# Altium schematic sheet JTAG.SchDoc
size A4
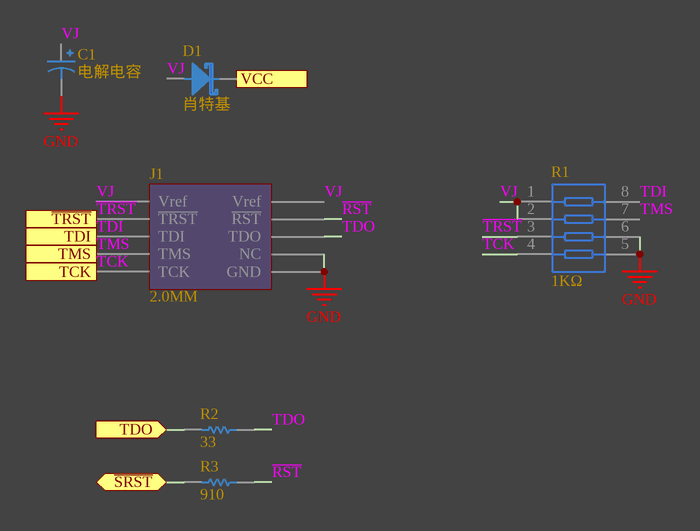
[diagram p0: JTAG.SchDoc]

## Parts
C1  电解电容  [贴片电解 4*5.4]
D1  肖特基  [SOD-123]
J1  2.0MM  [IDC-10P]
R1  1KΩ  [0603_Rx4]
R2  33  [R0603]
R3  910  [R0603]

## Ports
TCK (out), TDI (out), TDO (in), TMS (out), VCC (out), ~{SRST} (bidir), ~{TRST} (out)

## Nets
GND: C1.2 J1.8(NC) J1.10(GND) R1.5 R1.6
~{RST}: J1.4(~{RST}) R3.1
~{SRST}: R3.2 ; port ~{SRST}
~{TRST}: J1.3(~{TRST}) R1.3 ; port ~{TRST}
TCK: J1.9(TCK) R1.4 ; port TCK
TDI: J1.5(TDI) R1.8 ; port TDI
TDO: J1.6(TDO) R2.1
TDO: R2.2 ; port TDO  [a separate net that carries the same name]
TMS: J1.7(TMS) R1.7 ; port TMS
VCC: D1.2(K) ; port VCC
VJ: C1.1 D1.1(A) J1.1(Vref) J1.2(Vref) R1.1 R1.2

## Library data of the parts
C1 = 电解电容: Polarized Capacitor (Axial); Value: 100pF; Published: 8-Jun-2000; LatestRevisionDate: 17-Jul-2002; LatestRevisionNote: Re-released for DXP Platform.; PackageReference: POLAR0.8; Publisher: Altium Limited; PackageDescription: Polarized Capacitor; 2 Leads
D1 = 肖特基: Schottky Diode
J1 = JTAG-10P
R1 = 贴片排阻*4: 贴片排阻; ComponentLink1Description: 供应商链接; ComponentLink1URL: http://www.szlcsc.com/product/details_20907.html; Package: 0603*4; Supplier: LC; SuppliersPartNumber: C20197
R2 R3 = 电阻: Resistor; Value: 150R; Published: 8-Jun-2000; LatestRevisionDate: 17-Jul-2002; LatestRevisionNote: Re-released for DXP Platform.; PackageReference: AXIAL-0.3; Publisher: Altium Limited; PackageDescription: Axial Device, Thru-Hole; 2 Leads; 0.3 in Pin Spacing